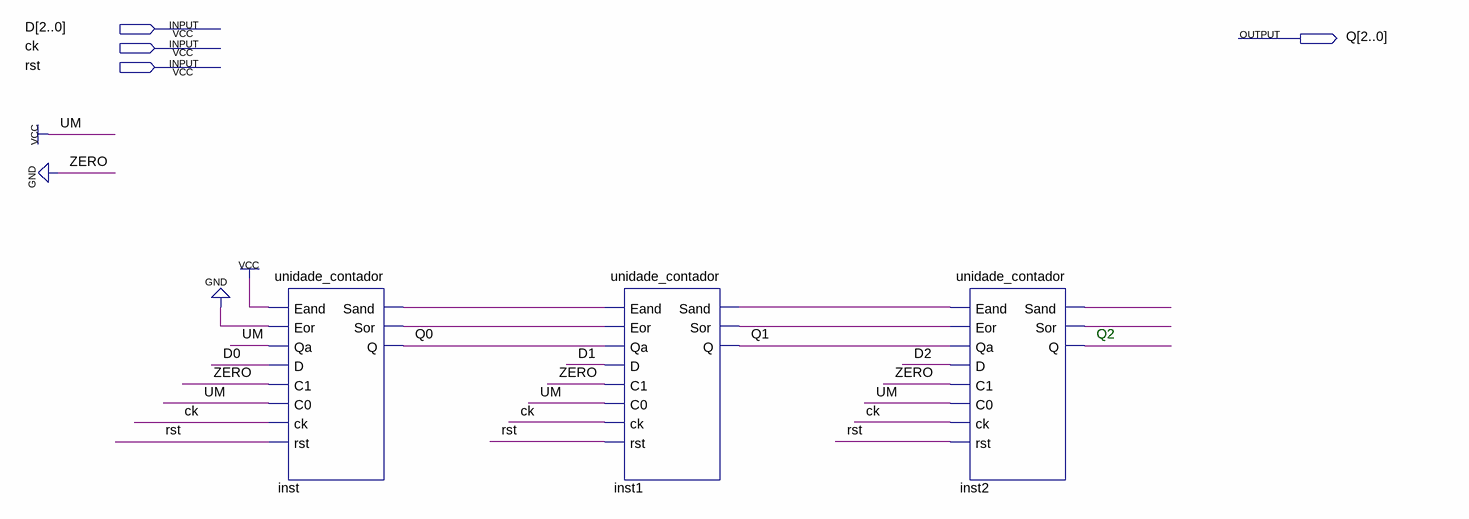
[diagram p0: schematic sheet]
// Quartus schematic contador_3bits.bdf as structural Verilog: 3 symbols, 4 pins
module contador_3bits (
  input  [2:0] D,
  input  ck,
  input  rst,
  output [2:0] Q
);

  wire inst1_sand, inst1_sor, inst2_sand, inst2_sor, inst_sand, inst_sor;

  unidade_contador inst (
    .Eand(1'b1), .Eor(1'b0), .Qa(1'b1), .D(D[0]), .C1(1'b0), .C0(1'b1), .ck(ck), .rst(rst), .Sand(inst_sand),
    .Sor(inst_sor), .Q(Q[0]));
  unidade_contador inst1 (
    .Eand(inst_sand), .Eor(inst_sor), .Qa(Q[0]), .D(D[1]), .C1(1'b0), .C0(1'b1), .ck(ck), .rst(rst),
    .Sand(inst1_sand), .Sor(inst1_sor), .Q(Q[1]));
  unidade_contador inst2 (
    .Eand(inst1_sand), .Eor(inst1_sor), .Qa(Q[1]), .D(D[2]), .C1(1'b0), .C0(1'b1), .ck(ck), .rst(rst),
    .Sand(inst2_sand), .Sor(inst2_sor), .Q(Q[2]));

  // Notes on the sheet:
  //   Q2
endmodule
